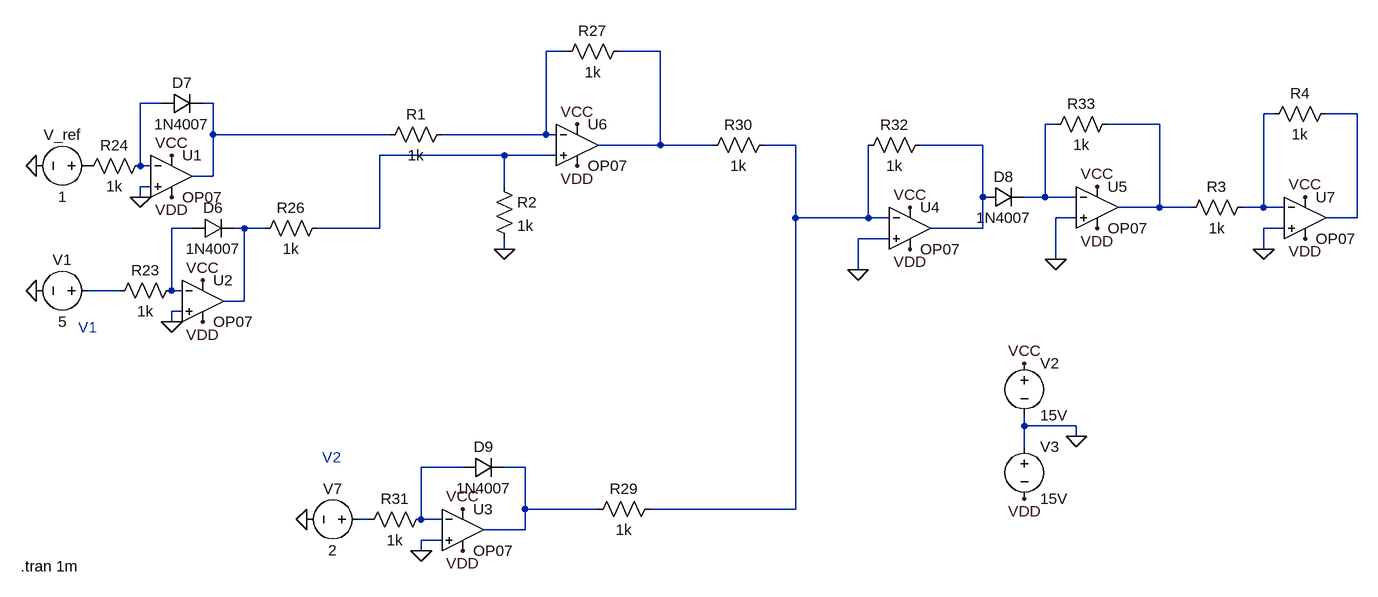
[diagram p0: schematic multiplier.asc]
multiplier.asc, the LTspice schematic file:
Version 4
SHEET 1 2036 1712
WIRE 816 848 784 848
WIRE 960 848 896 848
WIRE 192 928 160 928
WIRE 272 928 256 928
WIRE 1904 944 1888 944
WIRE 2032 944 1984 944
WIRE 1568 960 1552 960
WIRE 1728 960 1648 960
WIRE 272 976 272 928
WIRE 544 976 272 976
WIRE 784 976 784 848
WIRE 784 976 624 976
WIRE 800 976 784 976
WIRE 960 992 960 848
WIRE 960 992 864 992
WIRE 1040 992 960 992
WIRE 1168 992 1120 992
WIRE 1456 992 1360 992
WIRE 720 1008 528 1008
WIRE 800 1008 720 1008
WIRE 160 1024 160 928
WIRE 176 1024 160 1024
WIRE 272 1040 272 976
WIRE 272 1040 240 1040
WIRE 176 1056 160 1056
WIRE 720 1056 720 1008
WIRE 160 1072 160 1056
WIRE 1456 1072 1456 992
WIRE 1552 1072 1552 960
WIRE 1552 1072 1520 1072
WIRE 1600 1072 1552 1072
WIRE 1728 1088 1728 960
WIRE 1728 1088 1664 1088
WIRE 1776 1088 1728 1088
WIRE 1888 1088 1888 944
WIRE 1888 1088 1856 1088
WIRE 1920 1088 1888 1088
WIRE 1168 1104 1168 992
WIRE 1280 1104 1280 992
WIRE 1280 1104 1168 1104
WIRE 1312 1104 1280 1104
WIRE 1600 1104 1568 1104
WIRE 2032 1104 2032 944
WIRE 2032 1104 1984 1104
WIRE 240 1120 208 1120
WIRE 320 1120 304 1120
WIRE 352 1120 320 1120
WIRE 528 1120 528 1008
WIRE 528 1120 432 1120
WIRE 1456 1120 1456 1072
WIRE 1456 1120 1376 1120
WIRE 1920 1120 1888 1120
WIRE 1312 1136 1264 1136
WIRE 720 1152 720 1136
WIRE 1888 1152 1888 1120
WIRE 1568 1168 1568 1104
WIRE 1264 1184 1264 1136
WIRE 128 1216 80 1216
WIRE 208 1216 208 1120
WIRE 224 1216 208 1216
WIRE 320 1232 320 1120
WIRE 320 1232 288 1232
WIRE 224 1248 208 1248
WIRE 208 1264 208 1248
WIRE 1520 1424 1520 1408
WIRE 1600 1424 1520 1424
WIRE 1600 1440 1600 1424
WIRE 1520 1456 1520 1424
WIRE 656 1488 592 1488
WIRE 752 1488 720 1488
WIRE 752 1552 752 1488
WIRE 864 1552 752 1552
WIRE 1168 1552 1168 1104
WIRE 1168 1552 944 1552
WIRE 512 1568 496 1568
WIRE 592 1568 592 1488
WIRE 624 1568 592 1568
WIRE 752 1584 752 1552
WIRE 752 1584 688 1584
WIRE 624 1600 592 1600
WIRE 592 1616 592 1600
FLAG 208 1264 0
FLAG 160 1072 0
FLAG 0 1024 0
FLAG 416 1568 0
FLAG 592 1616 0
FLAG 1264 1184 0
FLAG 1568 1168 0
FLAG 0 1216 0
FLAG 720 1152 0
FLAG 1600 1440 0
FLAG 1520 1328 VCC
FLAG 1632 1056 VCC
FLAG 1344 1088 VCC
FLAG 832 960 VCC
FLAG 208 1008 VCC
FLAG 256 1200 VCC
FLAG 656 1552 VCC
FLAG 1520 1536 VDD
FLAG 1632 1120 VDD
FLAG 1344 1152 VDD
FLAG 832 1024 VDD
FLAG 656 1616 VDD
FLAG 256 1264 VDD
FLAG 208 1072 VDD
FLAG 1952 1072 VCC
FLAG 1952 1136 VDD
FLAG 1888 1152 0
SYMBOL res 224 1200 R90
WINDOW 0 0 56 VBottom 2
WINDOW 3 32 56 VTop 2
SYMATTR InstName R23
SYMATTR Value 1k
SYMBOL diode 240 1136 R270
WINDOW 0 32 32 VTop 2
WINDOW 3 0 32 VBottom 2
SYMATTR InstName D6
SYMATTR Value 1N4007
SYMBOL res 176 1008 R90
WINDOW 0 0 56 VBottom 2
WINDOW 3 32 56 VTop 2
SYMATTR InstName R24
SYMATTR Value 1k
SYMBOL diode 192 944 R270
WINDOW 0 32 32 VTop 2
WINDOW 3 0 32 VBottom 2
SYMATTR InstName D7
SYMATTR Value 1N4007
SYMBOL voltage 96 1024 R90
WINDOW 0 -32 56 VBottom 2
WINDOW 3 32 56 VTop 2
WINDOW 123 0 0 Left 0
WINDOW 39 0 0 Left 0
SYMATTR InstName V_ref
SYMATTR Value 1
SYMBOL res 448 1104 R90
WINDOW 0 0 56 VBottom 2
WINDOW 3 32 56 VTop 2
SYMATTR InstName R26
SYMATTR Value 1k
SYMBOL res 912 832 R90
WINDOW 0 0 56 VBottom 2
WINDOW 3 32 56 VTop 2
SYMATTR InstName R27
SYMATTR Value 1k
SYMBOL voltage 512 1568 R90
WINDOW 0 -32 56 VBottom 2
WINDOW 3 32 56 VTop 2
WINDOW 123 0 0 Left 0
WINDOW 39 0 0 Left 0
SYMATTR InstName V7
SYMATTR Value 2
SYMBOL res 608 1552 R90
WINDOW 0 0 56 VBottom 2
WINDOW 3 32 56 VTop 2
SYMATTR InstName R31
SYMATTR Value 1k
SYMBOL diode 656 1504 R270
WINDOW 0 32 32 VTop 2
WINDOW 3 0 32 VBottom 2
SYMATTR InstName D9
SYMATTR Value 1N4007
SYMBOL res 960 1536 R90
WINDOW 0 0 56 VBottom 2
WINDOW 3 32 56 VTop 2
SYMATTR InstName R29
SYMATTR Value 1k
SYMBOL res 1136 976 R90
WINDOW 0 0 56 VBottom 2
WINDOW 3 32 56 VTop 2
SYMATTR InstName R30
SYMATTR Value 1k
SYMBOL res 1376 976 R90
WINDOW 0 0 56 VBottom 2
WINDOW 3 32 56 VTop 2
SYMATTR InstName R32
SYMATTR Value 1k
SYMBOL diode 1456 1088 R270
WINDOW 0 32 32 VTop 2
WINDOW 3 0 32 VBottom 2
SYMATTR InstName D8
SYMATTR Value 1N4007
SYMBOL res 1664 944 R90
WINDOW 0 0 56 VBottom 2
WINDOW 3 32 56 VTop 2
SYMATTR InstName R33
SYMATTR Value 1k
SYMBOL res 640 960 R90
WINDOW 0 0 56 VBottom 2
WINDOW 3 32 56 VTop 2
SYMATTR InstName R1
SYMATTR Value 1k
SYMBOL voltage 96 1216 R90
WINDOW 0 -32 56 VBottom 2
WINDOW 3 32 56 VTop 2
WINDOW 123 0 0 Left 0
WINDOW 39 0 0 Left 0
SYMATTR InstName V1
SYMATTR Value 5
SYMBOL res 704 1040 R0
SYMATTR InstName R2
SYMATTR Value 1k
SYMBOL OpAmps\\OP07 208 976 R0
SYMATTR InstName U1
SYMBOL OpAmps\\OP07 256 1168 R0
SYMATTR InstName U2
SYMBOL OpAmps\\OP07 656 1520 R0
SYMATTR InstName U3
SYMBOL OpAmps\\OP07 1344 1056 R0
SYMATTR InstName U4
SYMBOL OpAmps\\OP07 1632 1024 R0
SYMATTR InstName U5
SYMBOL OpAmps\\OP07 832 928 R0
SYMATTR InstName U6
SYMBOL voltage 1520 1312 R0
WINDOW 123 0 0 Left 0
WINDOW 39 0 0 Left 0
SYMATTR InstName V2
SYMATTR Value 15V
SYMBOL voltage 1520 1440 R0
WINDOW 123 0 0 Left 0
WINDOW 39 0 0 Left 0
SYMATTR InstName V3
SYMATTR Value 15V
SYMBOL OpAmps\\OP07 1952 1040 R0
SYMATTR InstName U7
SYMBOL res 1872 1072 R90
WINDOW 0 0 56 VBottom 2
WINDOW 3 32 56 VTop 2
SYMATTR InstName R3
SYMATTR Value 1k
SYMBOL res 2000 928 R90
WINDOW 0 0 56 VBottom 2
WINDOW 3 32 56 VTop 2
SYMATTR InstName R4
SYMATTR Value 1k
TEXT 64 1272 Left 2 ;V1
TEXT 440 1472 Left 2 ;V2
TEXT -24 1640 Left 2 !.tran 1m

The netlist it stands for:
* multiplier.asc
R23 N012 N014 1k
D6 N012 N013 1N4007
R24 N003 P001 1k
D7 N003 N004 1N4007
V_ref P001 0 1
R26 N011 N013 1k
R27 N002 N001 1k
V7 N017 0 2
R31 N015 N017 1k
D9 N015 N016 1N4007
R29 N009 N016 1k
R30 N009 N002 1k
R32 N010 N009 1k
D8 N010 N007 1N4007
R33 N008 N007 1k
R1 N001 N004 1k
V1 N014 0 5
R2 N011 0 1k
XU1 0 N003 VCC VDD N004 LT1001  ; OP07, pins In+ In- V+ V- OUT
XU2 0 N012 VCC VDD N013 LT1001  ; OP07, pins In+ In- V+ V- OUT
XU3 0 N015 VCC VDD N016 LT1001  ; OP07, pins In+ In- V+ V- OUT
XU4 0 N009 VCC VDD N010 LT1001  ; OP07, pins In+ In- V+ V- OUT
XU5 0 N007 VCC VDD N008 LT1001  ; OP07, pins In+ In- V+ V- OUT
XU6 N011 N001 VCC VDD N002 LT1001  ; OP07, pins In+ In- V+ V- OUT
V2 VCC 0 15V
V3 0 VDD 15V
XU7 0 N005 VCC VDD N006 LT1001  ; OP07, pins In+ In- V+ V- OUT
R3 N005 N008 1k
R4 N006 N005 1k
.model D D
.lib standard.dio
* V1
* V2
.tran 1m
.lib LTC.lib
.backanno
.end